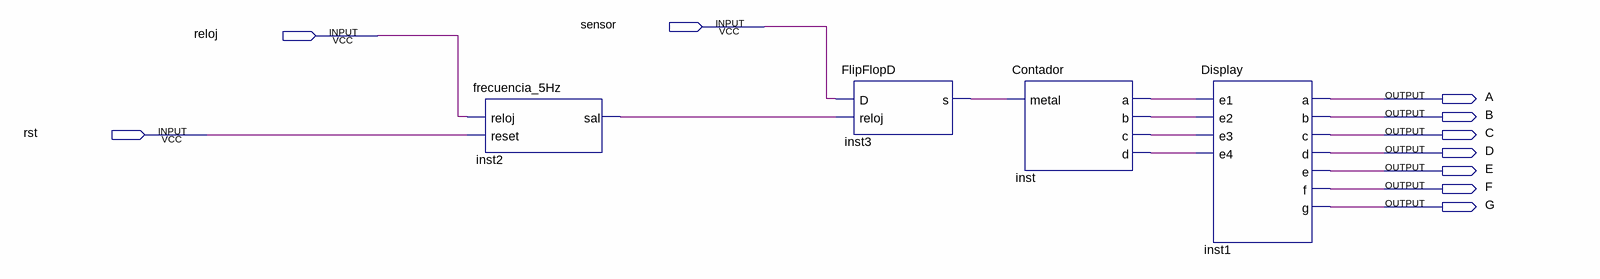
[diagram p0: schematic sheet]
// Quartus schematic schema.bdf as structural Verilog: 4 symbols, 10 pins
module schema (
  input  sensor,
  input  reloj,
  input  rst,
  output A,
  output B,
  output C,
  output D,
  output E,
  output F,
  output G
);

  wire inst2_sal, inst3_s, inst_a, inst_b, inst_c, inst_d;

  frecuencia_5Hz inst2 (.reloj(reloj), .reset(rst), .sal(inst2_sal));
  FlipFlopD inst3 (.D(sensor), .reloj(inst2_sal), .s(inst3_s));
  Contador inst (.metal(inst3_s), .a(inst_a), .b(inst_b), .c(inst_c), .d(inst_d));
  Display inst1 (.e1(inst_a), .e2(inst_b), .e3(inst_c), .e4(inst_d), .a(A), .b(B), .c(C), .d(D), .e(E), .f(F), .g(G));
endmodule
